# EAGLE design receiver (EAGLE 7.5.0)
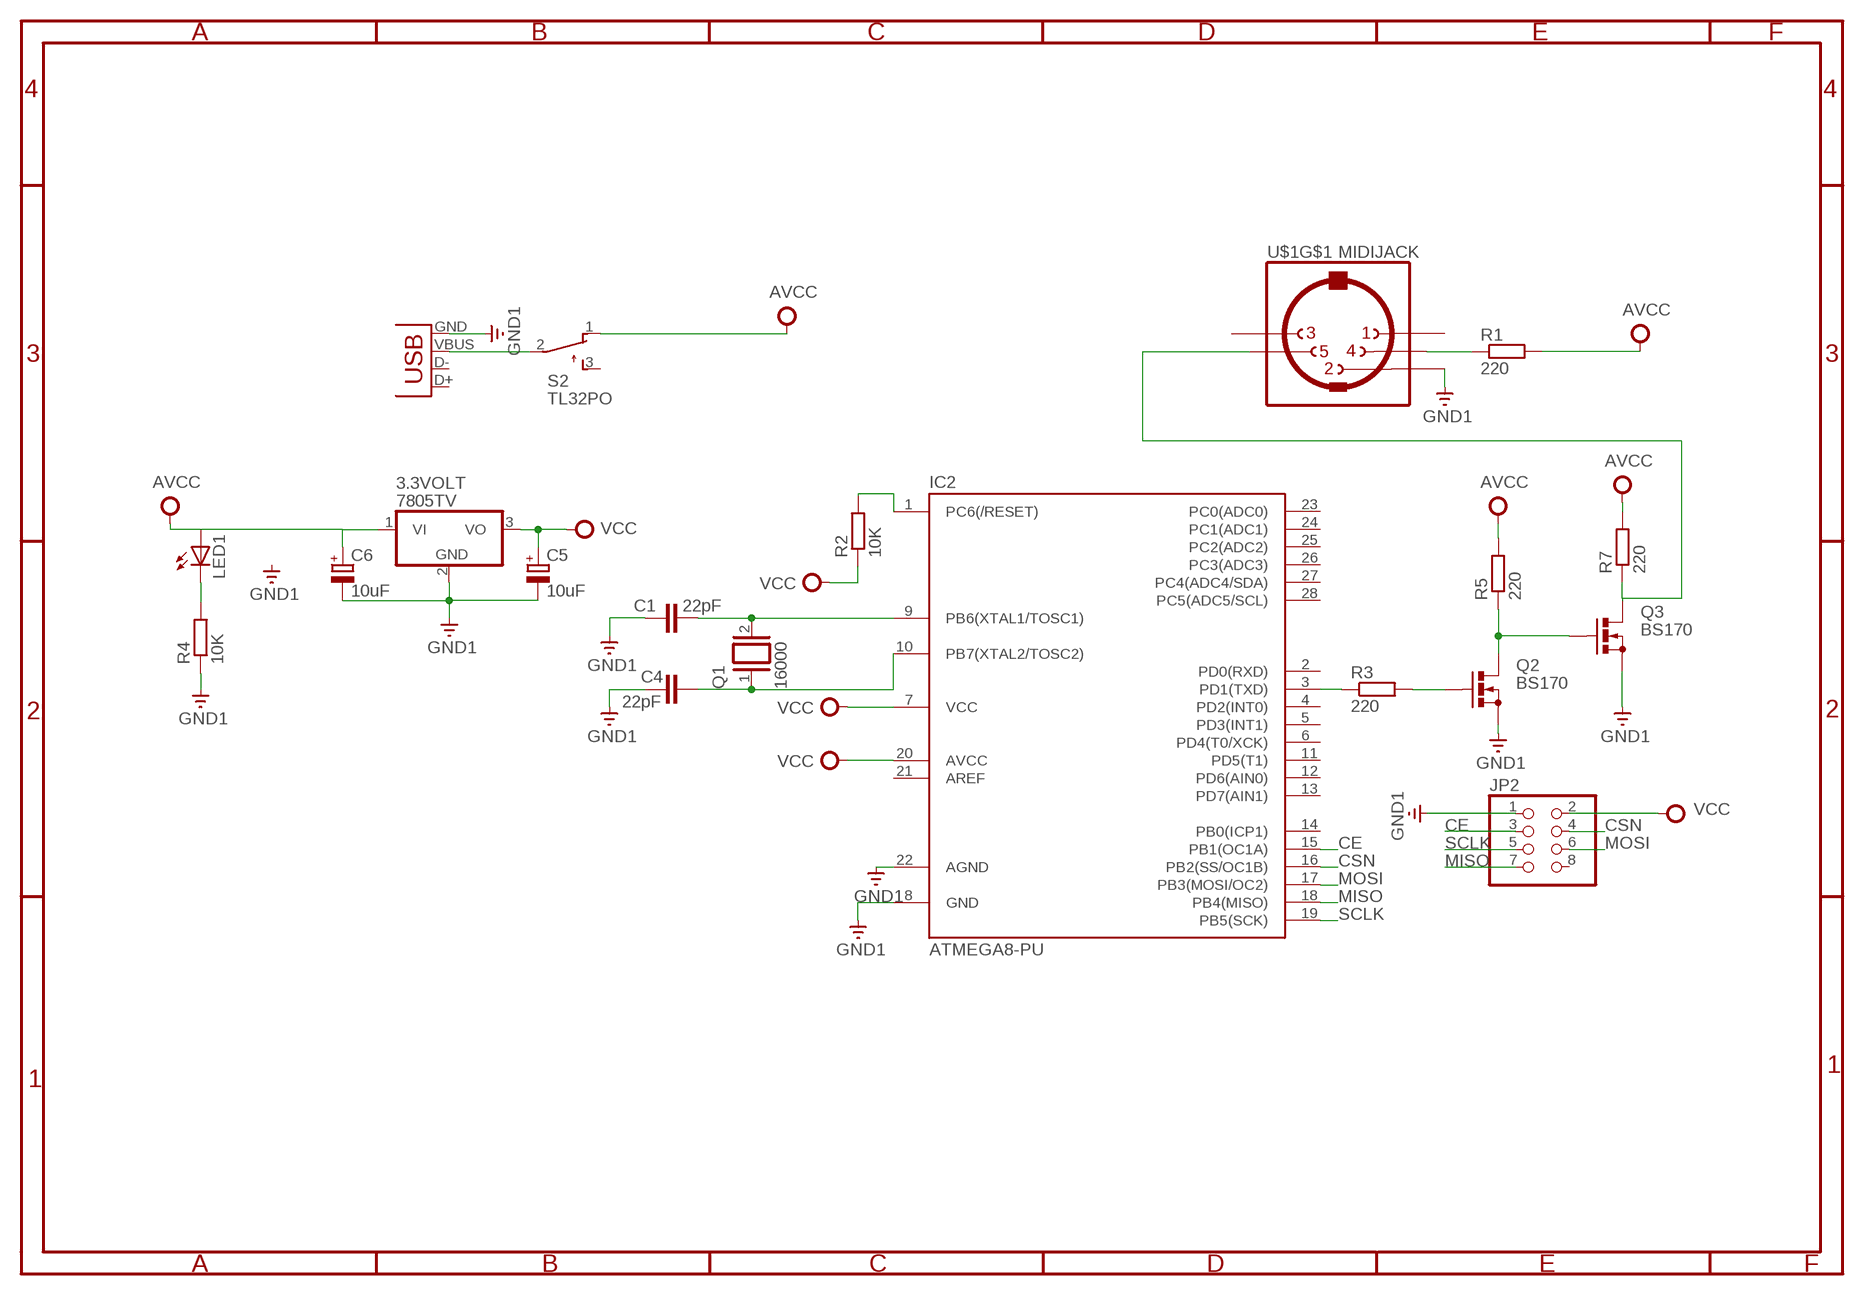
[diagram p0: schematic, sheet 1]

## Parts
3.3VOLT  7805TV  [TO220V]
C1  22pF  C-EU050-025X075  [C050-025X075]
C4  22pF  C-EU050-025X075  [C050-025X075]
C5  10uF  CPOL-EUE2.5-5  [E2,5-5]
C6  10uF  CPOL-EUE2.5-5  [E2,5-5]
IC2  ATMEGA8-PU  [DIL28-3]
JP2  PINHD-2X4  [2X04]
LED1  LED5MM  [LED5MM]
Q1  16000  XTAL/S  [QS]
Q2  BS170  [SOT54E]
Q3  BS170  [SOT54E]
R1  220  R0204/7  [0204/7]
R2  10K  R0204/7  [0204/7]
R3  220  R0204/7  [0204/7]
R4  10K  R0204/7  [0204/7]
R5  220  R0204/7  [0204/7]
R7  220  R0204/7  [0204/7]
S2  TL32PO  [TL3XPO]
U$1  MIDIJACK  [CP-2350]
X1  USB-B-H  [USB-B-H]

## Nets
AVCC: 3.3VOLT.1(VI) C6.+ LED1.A R1.2 R5.2 R7.2 S2.1(O)
CE: IC2.15(PB1(OC1A)) JP2.3
CSN: IC2.16(PB2(SS/OC1B)) JP2.4
GND1: 3.3VOLT.2(GND) C1.1 C4.1 C5.- C6.- IC2.8(GND) IC2.22(AGND) JP2.1 Q2.S Q3.S R4.1 U$1.2 X1.GND
MISO: IC2.18(PB4(MISO)) JP2.7
MOSI: IC2.17(PB3(MOSI/OC2)) JP2.6
N$1: C1.2 IC2.9(PB6(XTAL1/TOSC1)) Q1.2
N$2: C4.2 IC2.10(PB7(XTAL2/TOSC2)) Q1.1
N$3: S2.2(P) X1.VBUS
N$4: LED1.K(C) R4.2
N$5: IC2.3(PD1(TXD)) R3.1
N$6: Q2.G R3.2
N$7: IC2.1(PC6(/RESET)) R2.2
N$8: Q2.D Q3.G R5.1
N$10: R1.1 U$1.4
N$12: Q3.D R7.1 U$1.5
SCLK: IC2.19(PB5(SCK)) JP2.5
VCC: 3.3VOLT.3(VO) C5.+ IC2.7(VCC) IC2.20(AVCC) JP2.2 R2.1
Unconnected: IC2.2(PD0(RXD)) IC2.4(PD2(INT0)) IC2.5(PD3(INT1)) IC2.6(PD4(T0/XCK)) IC2.11(PD5(T1)) IC2.12(PD6(AIN0)) IC2.13(PD7(AIN1)) IC2.14(PB0(ICP1)) IC2.21(AREF) IC2.23(PC0(ADC0)) IC2.24(PC1(ADC1)) IC2.25(PC2(ADC2)) IC2.26(PC3(ADC3)) IC2.27(PC4(ADC4/SDA)) IC2.28(PC5(ADC5/SCL)) JP2.8 S2.3(S) U$1.1 U$1.3 U$1.PE1(MT) U$1.PE2(MT) U$1.PE(MT) U$1.PE@(MT) X1.D+ X1.D-

## Library data of the parts
3.3VOLT = linear:78*: Positive VOLTAGE REGULATOR Source: http://cache.national.com/ds/LM/LM78L05.pdf http://www.fairchildsemi.com/ds/LM/LM7805.pdf
C1 C4 = rcl-2:C-EU: CAPACITOR, European symbol
C5 C6 = qfm-trx1-24g:CPOL-EU: POLARIZED CAPACITOR, European symbol
IC2 = atmega8:ATMEGA8-PU
JP2 = pinhead:PINHD-2X4: PIN HEADER
LED1 = led:LED: LED OSRAM: - CHIPLED LG R971, LG N971, LY N971, LG Q971, LY Q971, LO R971, LY R971 LH N974, LH R974 LS Q976, LO Q976, LY Q976 LO Q996 - Hyper CHIPLED LW Q18S LB Q993, LB Q99A, LB R99A - SideLED LS A670, LO A670, LY A670, LG A670, LP A670 LB A673, LV A673, LT A673, LW A673 LH A674 LY A675 LS A676, LA A676, LO A676, LY A676, LW A676 LS A679, LY A679, LG A679 - Hyper Micro SIDELED® LS Y876, LA Y876, LO Y876, LY Y876 LT Y87S - SmartLED LW L88C, LW L88S LB L89C, LB L89S, LG L890 LS L89K, LO L89K, LY L89K LS L896, LA L896, LO L896, LY L896 - TOPLED LS T670, LO T670, LY T670, LG T670, LP T670 LSG T670, LSP T670, LSY T670, LOP T670, LYG T670 LG T671, LOG T671, LSG T671 LB T673, LV T673, LT T673, LW T673 LH T674 LS T676, LA T676, LO T676, LY T676, LB T676, LH T676, LSB T676, LW T676 LB T67C, LV T67C, LT T67C, LS T67K, LO T67K, LY T67K, LW E67C LS E67B, LA E67B, LO E67B, LY E67B, LB E67C, LV E67C, LT E67C LW T67C LS T679, LY T679, LG T679 LS T770, LO T770, LY T770, LG T770, LP T770 LB T773, LV T773, LT T773, LW T773 LH T774 LS E675, LA E675, LY E675, LS T675 LS T776, LA T776, LO T776, LY T776, LB T776 LHGB T686 LT T68C, LB T68C - Hyper Mini TOPLED® LB M676 - Mini TOPLED Santana® LG M470 LS M47K, LO M47K, LY M47K Source: http://www.osram.convergy.de LUXEON: - LUMILED® LXK2-PW12-R00, LXK2-PW12-S00, LXK2-PW14-U00, LXK2-PW14-V00 LXK2-PM12-R00, LXK2-PM12-S00, LXK2-PM14-U00 LXK2-PE12-Q00, LXK2-PE12-R00, LXK2-PE12-S00, LXK2-PE14-T00, LXK2-PE14-U00 LXK2-PB12-K00, LXK2-PB12-L00, LXK2-PB12-M00, LXK2-PB14-N00, LXK2-PB14-P00, LXK2-PB14-Q00 LXK2-PR12-L00, LXK2-PR12-M00, LXK2-PR14-Q00, LXK2-PR14-R00 LXK2-PD12-Q00, LXK2-PD12-R00, LXK2-PD12-S00 LXK2-PH12-R00, LXK2-PH12-S00 LXK2-PL12-P00, LXK2-PL12-Q00, LXK2-PL12-R00 Source: www.luxeon.com KINGBRIGHT: KA-3528ASYC Source: www.kingbright.com
Q1 = special:XTAL/S: CRYSTAL
Q2 Q3 = transistor-small-signal:BS170: N-CHANNEL MOS FET
R1-R5 R7 = eagle-ltspice:R: RESISTOR, European symbol; SPICEMODEL: NONE; SPICEPREFIX: R
S2 = switch:TL32PO: TINY SWITCH ON - MOM Source: http://www2.produktinfo.conrad.com/datenblaetter/700000-724999/705152-da-01-de-Subminiaturschalter_TL_36YO.pdf
U$1 = adafruit:MIDIJACK: DIN 5 jack also known as MIDI jack A modification of conn-hirshman:MAB5SH with two options for the grounding 'teeth'
X1 = con-usb:USB: USB Connectors

## Board
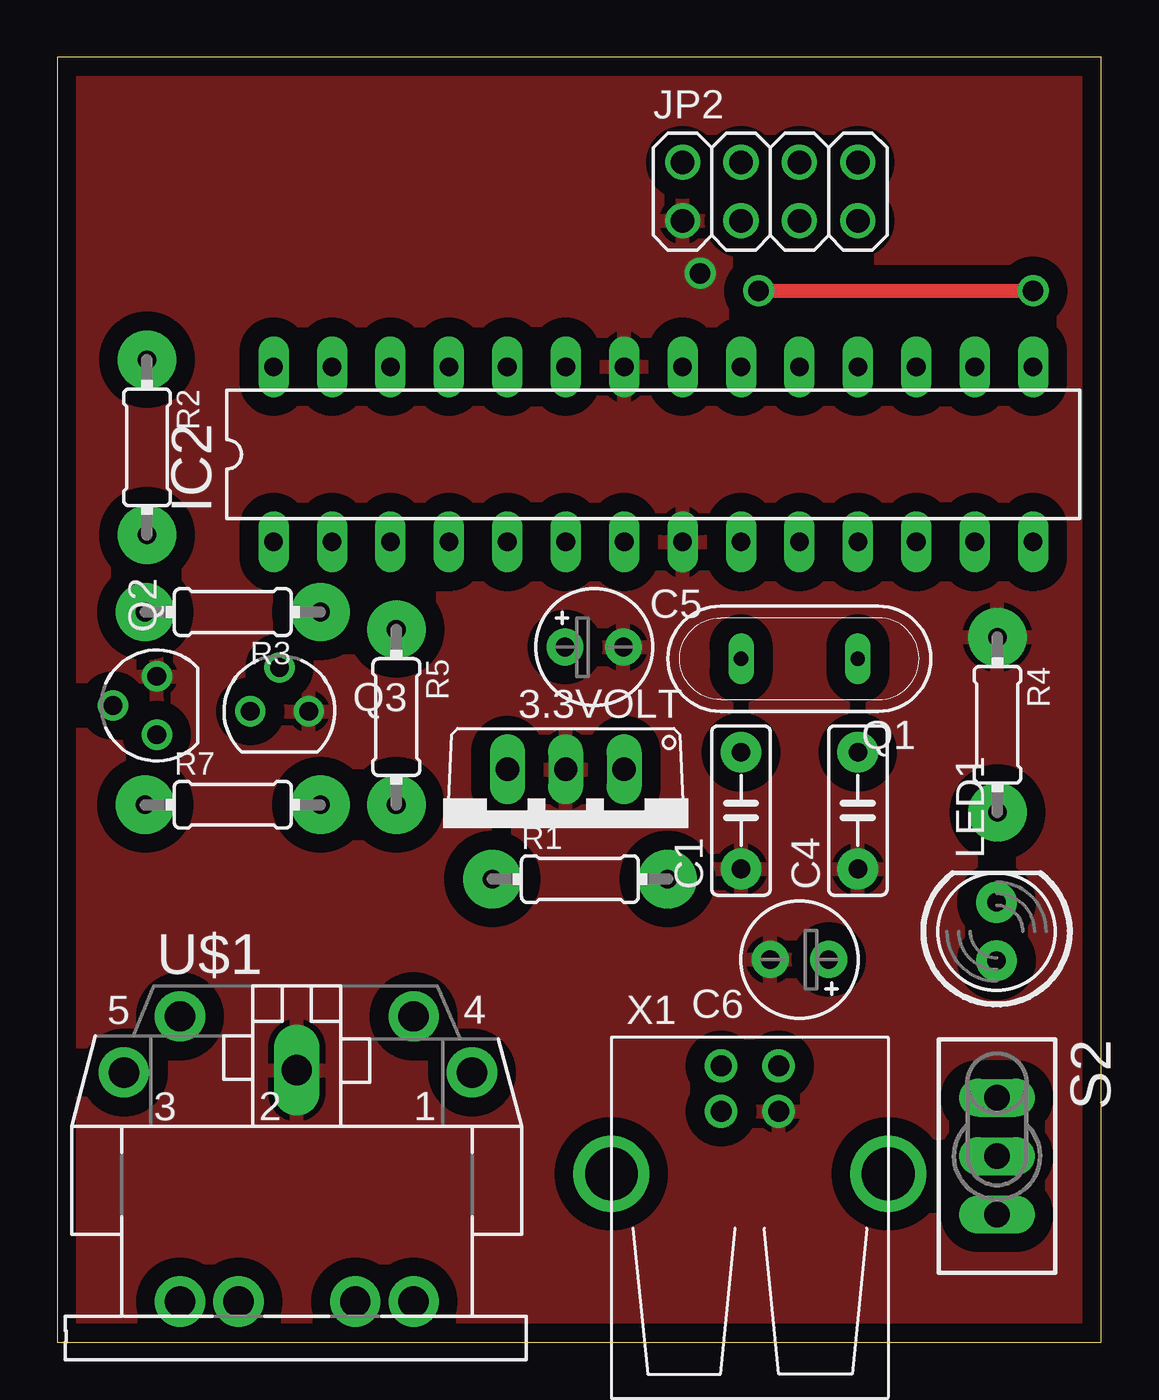
[diagram p1: board, top side]
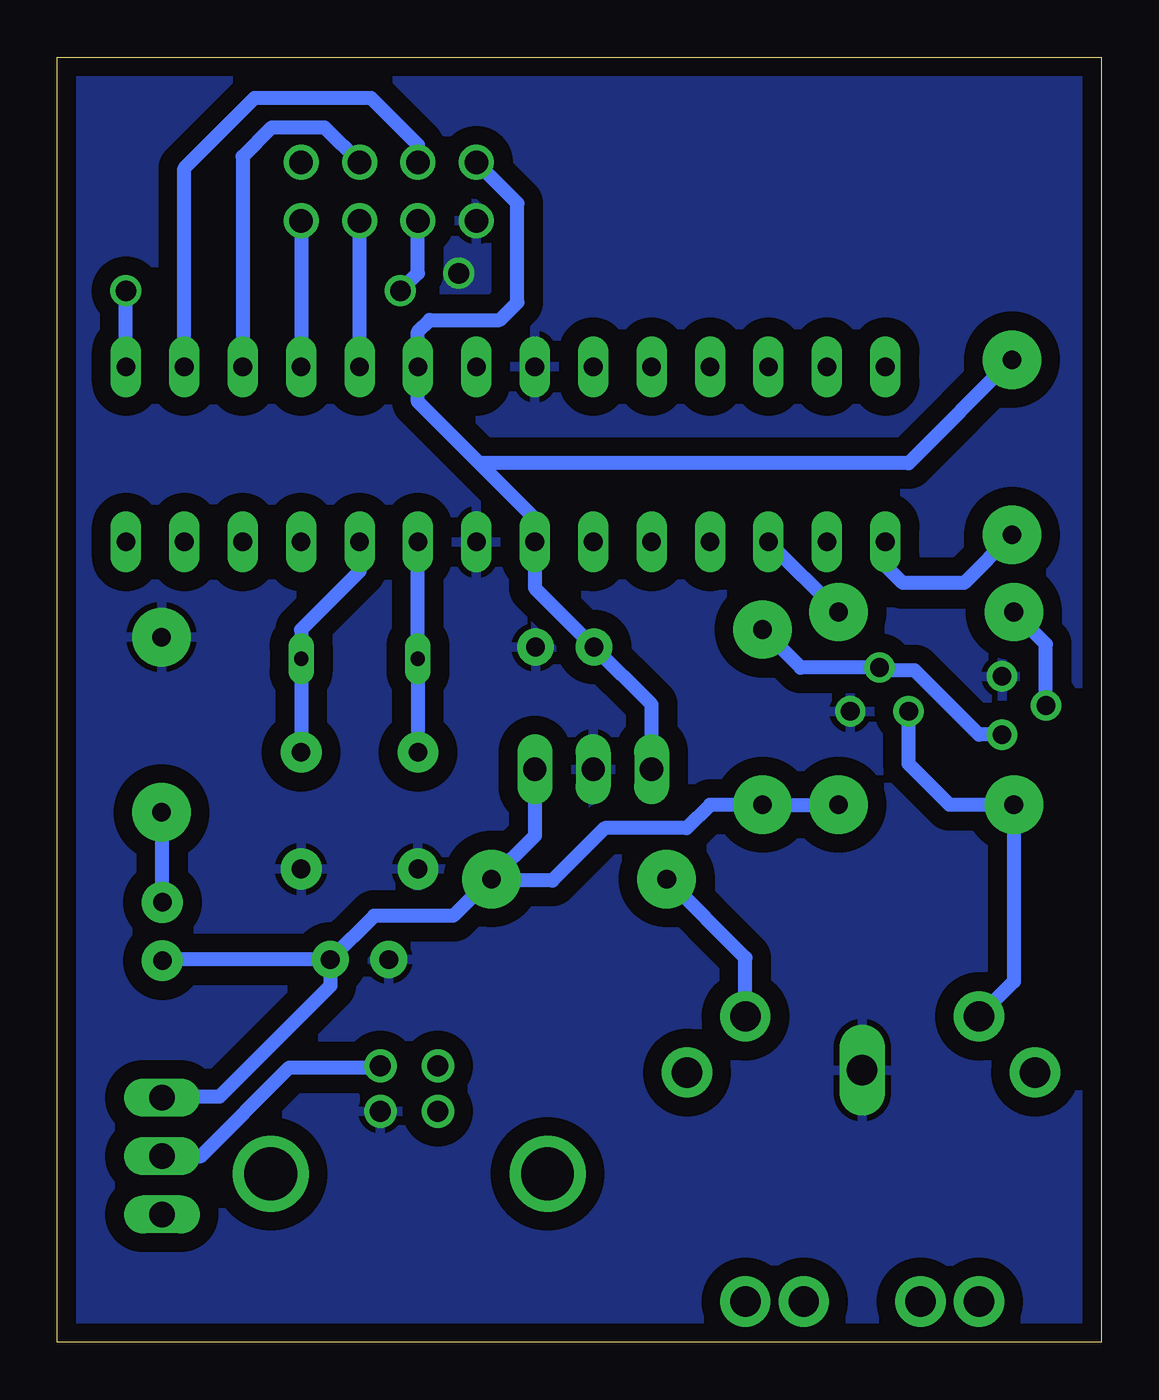
[diagram p2: board, bottom side, seen from below]

Size 45.39 x 55.87 mm. Coordinates in mm from the lower left corner, seen from the top.
Outline: 0,0 45.39,0 45.39,55.87 0,55.87 0,0
Copper layers (1*16): Top 0.035mm / dielectric 1.5mm / Bottom 0.035mm
Design rules "TE": minimum track width 12mil, minimum drill 23mil, track to track 10mil, track to pad 10mil, pad to pad 10mil, via to via 10mil, smd to smd 10mil, copper to edge 20mil, drill to drill 8mil, minimum pad ring 10mil, minimum via ring 8mil, stop-mask expansion 4mil, vias tented up to drill 0mil, thermal gap 10mil

### Footprints (pad centres in the part's own frame; a part is rotated, then mirrored left to right if it is on the bottom)
TO220V = drill 1.016 long: 1 -2.54,-2.54; 2 0,-2.54; 3 2.54,-2.54
C050-025X075 = drill 0.813 pad 1.778: 1 -2.54,0; 2 2.54,0
E2,5-5 = drill 0.813 pad 1.6: + -1.27,0; - 1.27,0
DIL28-3 = drill 0.813 long: 1 -16.51,-3.81; 2 -13.97,-3.81; 3 -11.43,-3.81; 4 -8.89,-3.81; 5 -6.35,-3.81; 6 -3.81,-3.81; 7 -1.27,-3.81; 8 1.27,-3.81; 9 3.81,-3.81; 10 6.35,-3.81; 11 8.89,-3.81; 12 11.43,-3.81; 13 13.97,-3.81; 14 16.51,-3.81; 15 16.51,3.81; 16 13.97,3.81; 17 11.43,3.81; 18 8.89,3.81; 19 6.35,3.81; 20 3.81,3.81; 21 1.27,3.81; 22 -1.27,3.81; 23 -3.81,3.81; 24 -6.35,3.81; 25 -8.89,3.81; 26 -11.43,3.81; 27 -13.97,3.81; 28 -16.51,3.81
2X04 = drill 1.016: 1 -3.81,-1.27; 2 -3.81,1.27; 3 -1.27,-1.27; 4 -1.27,1.27; 5 1.27,-1.27; 6 1.27,1.27; 7 3.81,-1.27; 8 3.81,1.27
LED5MM = drill 0.813 pad 1.778: A -1.27,0; K 1.27,0
QS = drill 0.61 long: 1 -2.54,0; 2 2.54,0
SOT54E = drill 0.813: D -1.27,0; G 0,1.905; S 1.27,0
0204/7 = drill 0.813 pad 2.54: 1 -3.81,0; 2 3.81,0
TL3XPO = drill 1.1 pad 1.422 long: 1 -2.54,0; 2 0,0; 3 2.54,0
CP-2350 = drill 1.321 pad 2.184: 1 7.62,12.58; 3 -7.52,12.58; 4 5.08,15.02; 5 -5.08,15.02; PE -2.54,2.62; PE1 -5.08,2.62; PE2 5.08,2.62; PE@ 2.54,2.62 | drill 1.321 long: 2 0,12.68
USB-B-H = drill 0.914: D+ 0,1.25; D- 1.981,1.25; GND 0,-1.25; VBUS 1.981,-1.25 | drill 2.286: P$1 -2.718,-6.02; P$2 -2.718,6.02

### Placement (x,y rotation side)
3.3VOLT  22.1,22.37 180 top
C1  29.72,23.11 90 top
C4  34.8,23.11 90 top
C5  23.34,30.23 0 top
C6  32.26,16.64 180 top
IC2  25.91,38.61 0 top
JP2  30.99,50.04 0 top
LED1  40.83,17.86 90 top
Q1  32.26,29.72 180 top
Q2  4.32,27.69 90 top
Q3  9.65,27.43 0 top
R1  22.71,20.14 0 top
R2  3.89,38.91 270 top
R3  7.62,31.75 180 top
R4  40.87,26.85 270 top
R5  14.73,27.18 270 top
R7  7.62,23.37 0 top
S2  40.85,8.09 270 top
U$1  10.4,-0.86 0 top
X1  30.1,10.03 90 top

### Tracks (layer width: path | path; a pad name or v marks a point on that pad's centre or on a via)
AVCC
  Bottom 0.61: C6.+ 33.53,15.49 38.35,10.67 40.81,10.67 S2.1 | C6.+ 40.78,16.64 LED1.A | R1.2 26.6,20.14 28.19,18.54 31.62,18.54 C6.+ | 3.3VOLT.1 24.64,22.02 R1.2 | R7.2 R5.2 17.02,23.37 18.03,22.35 21.59,22.35 23.88,20.07 26.45,20.07 R1.2
CE  (via drill 0.9 pad 0.61)
  Top 0.61: v30.48,45.72 v42.42,45.72
  Bottom 0.61: v30.48,45.72 29.72,46.48 JP2.3 | IC2.15 v42.42,45.72
CSN
  Bottom 0.61: JP2.4 29.72,52.07 31.75,54.1 36.83,54.1 39.88,51.05 IC2.16
GND1  (via drill 0.9 pad 0.61)
  other vias: 27.94,46.48
  pour Bottom (isolate 0.813): 0,55.88 -0.25,0 45.21,-0.25 45.47,55.88
  pour Top (isolate 0.813): 0,55.88 45.21,55.88 45.21,-1.27 0,-1.27
MISO
  Bottom 0.61: JP2.7 IC2.18
MOSI
  Bottom 0.61: JP2.6 33.78,52.83 36.07,52.83 37.34,51.56 IC2.17
N$1
  Bottom 0.61: C1.2 Q1.2 IC2.9
N$2
  Bottom 0.61: C4.2 Q1.1 34.8,30.99 32.26,33.53 IC2.10
N$3
  Bottom 0.61: S2.2 39.16,8.09 35.31,11.94 31.43,11.94 X1.VBUS
N$4
  Bottom 0.61: LED1.K 40.83,23 R4.2
N$5
  Bottom 0.61: R3.1 IC2.3
N$6
  Bottom 0.61: Q2.G 2.41,30.35 R3.2
N$7
  Bottom 0.61: R2.2 5.97,33.02 8.64,33.02 9.4,33.78 IC2.1
N$8
  Bottom 0.61: R5.1 13.08,29.34 Q3.G 9.52,29.21 8.13,29.21 5.33,26.42 Q2.D
N$10
  Bottom 0.61: U$1.4 15.48,16.72 R1.1
N$12
  Bottom 0.61: 5.32,14.21 U$1.5 3.81,15.68 R7.1 6.6,23.37 8.38,25.15 Q3.D
SCLK
  Bottom 0.61: IC2.19 JP2.5
VCC
  Bottom 0.61: JP2.2 25.4,49.53 25.4,45.21 26.16,44.45 29.21,44.45 29.72,43.94 IC2.20 29.72,40.89 27.05,38.23 | 27.05,38.23 24.64,35.81 IC2.7 24.64,32.8 C5.+ 19.56,27.72 3.3VOLT.3 | R2.1 8.39,38.23 27.05,38.23